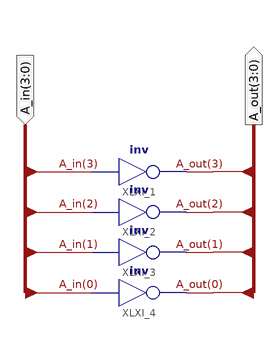
[diagram p0: schematic sheet 1]
// Xilinx ISE schematic inverter4bit.sch (spartan6) as structural Verilog: 4 symbols, 2 ports
module inverter4bit (
  input  [3:0] A_in,
  output [3:0] A_out
);

  not XLXI_1 (A_out[3], A_in[3]);
  not XLXI_2 (A_out[2], A_in[2]);
  not XLXI_3 (A_out[1], A_in[1]);
  not XLXI_4 (A_out[0], A_in[0]);
endmodule
